# EAGLE design 5VAC-DC (EAGLE 9.6.2)
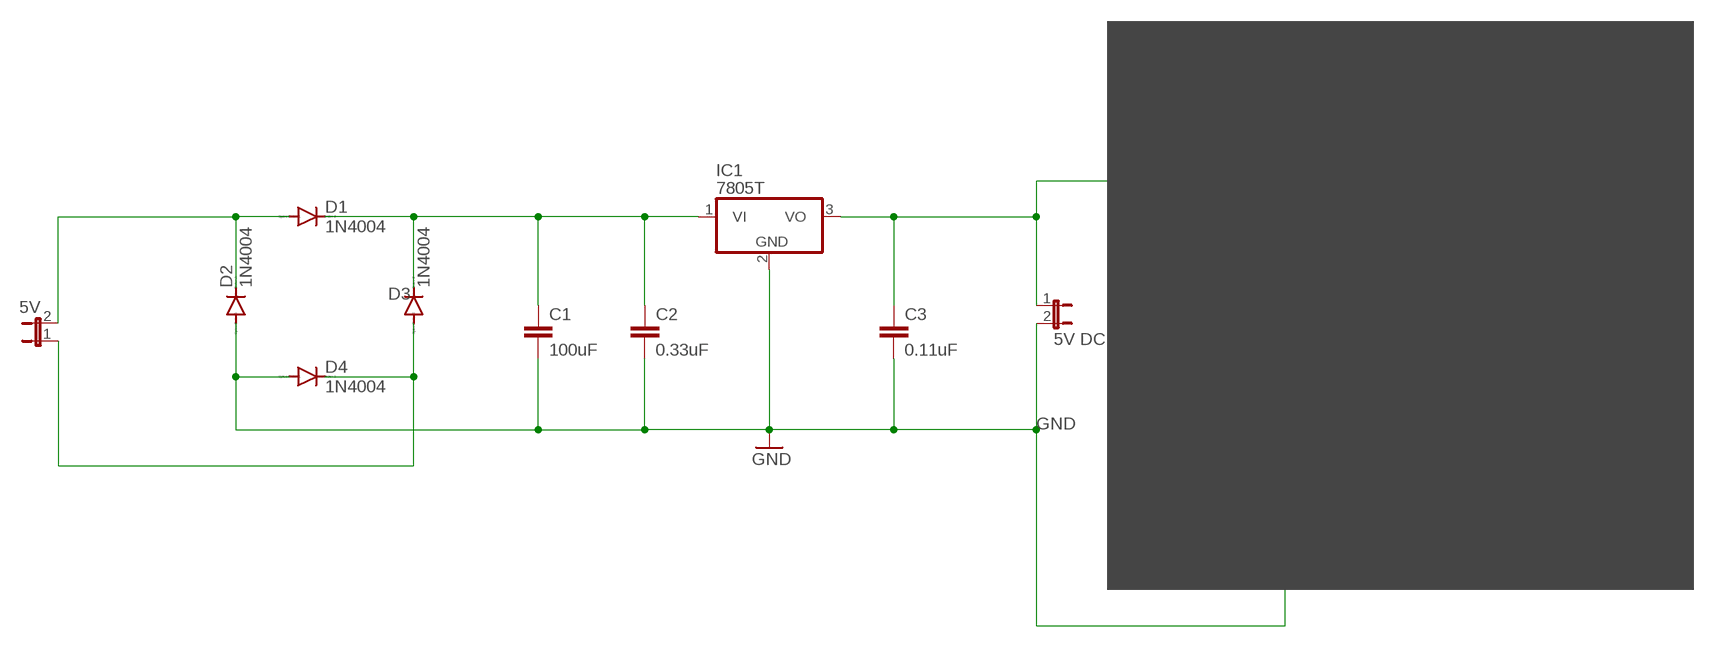
[diagram p0: schematic, sheet 1]

## Parts
C1  100uF  C2,5-3  [C2.5-3]
C2  0.33uF  C2,5-3  [C2.5-3]
C3  0.11uF  C2,5-3  [C2.5-3]
D1  1N4004  [DO41-10]
D2  1N4004  [DO41-10]
D3  1N4004  [DO41-10]
D4  1N4004  [DO41-10]
I/P  5V  JP1E  [JP1]
IC1  7805T  [TO220H]
JP2  5V DC  JP1E  [JP1]
U$1  MEGA8L-DEV  [TQFP-MEGA8]

## Nets
GND: C1.2 C2.2 C3.2 D2.A D4.A IC1.2(GND) JP2.2 U$1.P$9
N$1: D1.A D2.C I/P.2
N$3: D3.A D4.C I/P.1
N$4: C1.1 C2.1 D1.C D3.C IC1.1(VI)
N$7: C3.1 IC1.3(VO) JP2.1 U$1.P$1
Unconnected: U$1.P$2 U$1.P$3 U$1.P$4 U$1.P$5 U$1.P$6 U$1.P$7 U$1.P$8 U$1.P$10 U$1.P$11 U$1.P$12 U$1.P$13 U$1.P$14 U$1.P$15 U$1.P$16 U$1.P$17 U$1.P$18 U$1.P$19 U$1.P$20 U$1.P$21 U$1.P$22 U$1.P$23 U$1.P$24 U$1.P$25 U$1.P$26 U$1.P$27 U$1.P$28 U$1.P$29 U$1.P$30 U$1.P$31 U$1.P$32

## Library data of the parts
C1-C3 = capacitor-wima:C: CAPACITOR naming: grid - package width
D1-D4 = diode:1N4004: DIODE general purpose rectifier, 1 A
I/P JP2 = jumper:JP1E: JUMPER
IC1 = linear:78*: Positive VOLTAGE REGULATOR Source: http://cache.national.com/ds/LM/LM78L05.pdf http://www.fairchildsemi.com/ds/LM/LM7805.pdf
U$1 = anjana:MEGA8L-DEV

## Board
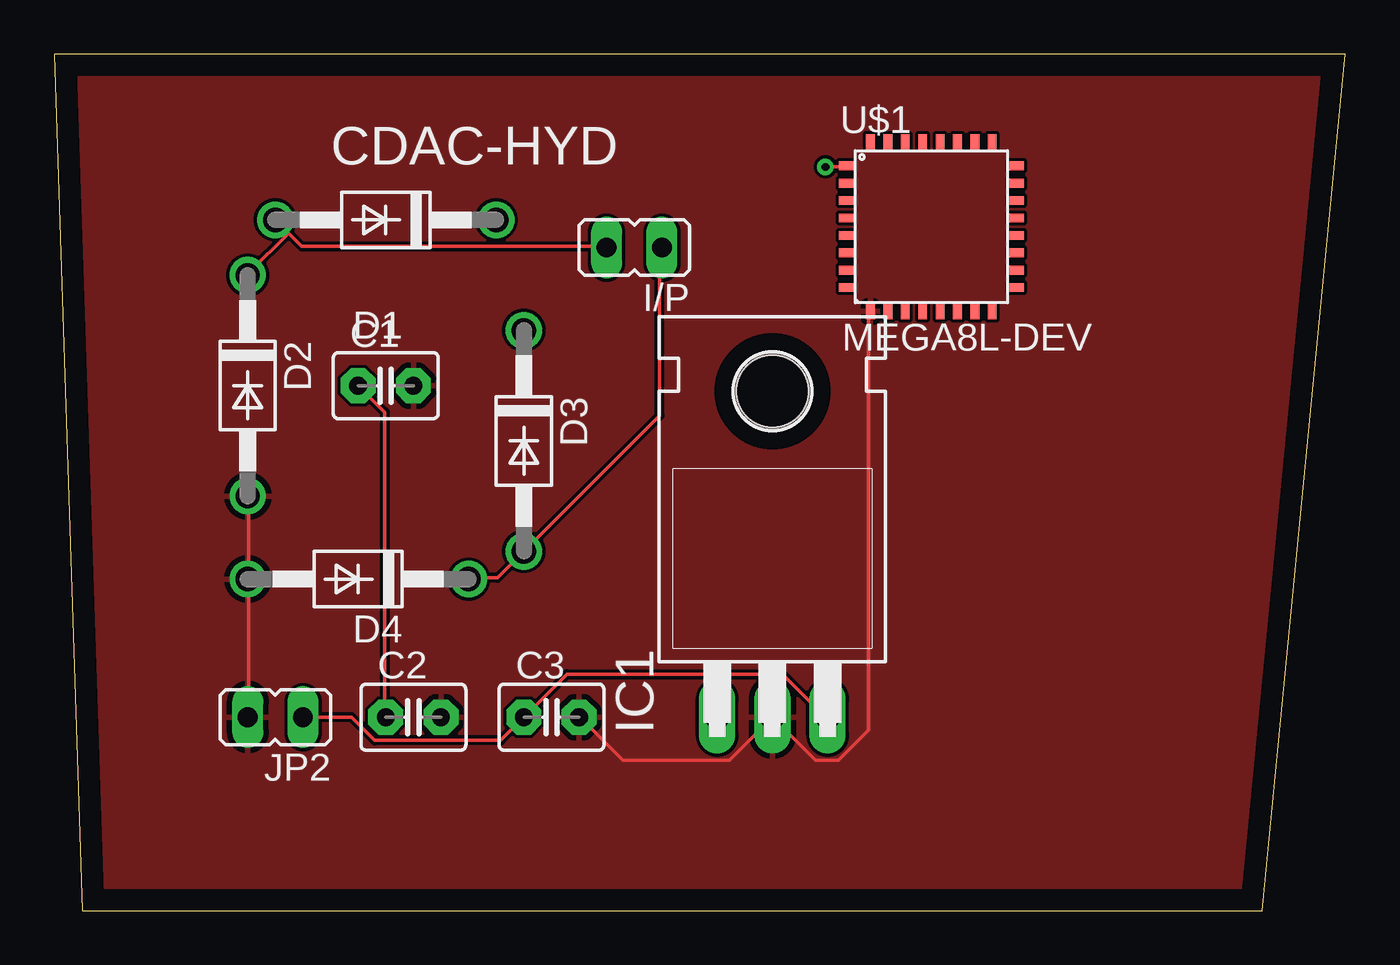
[diagram p1: board, top side]
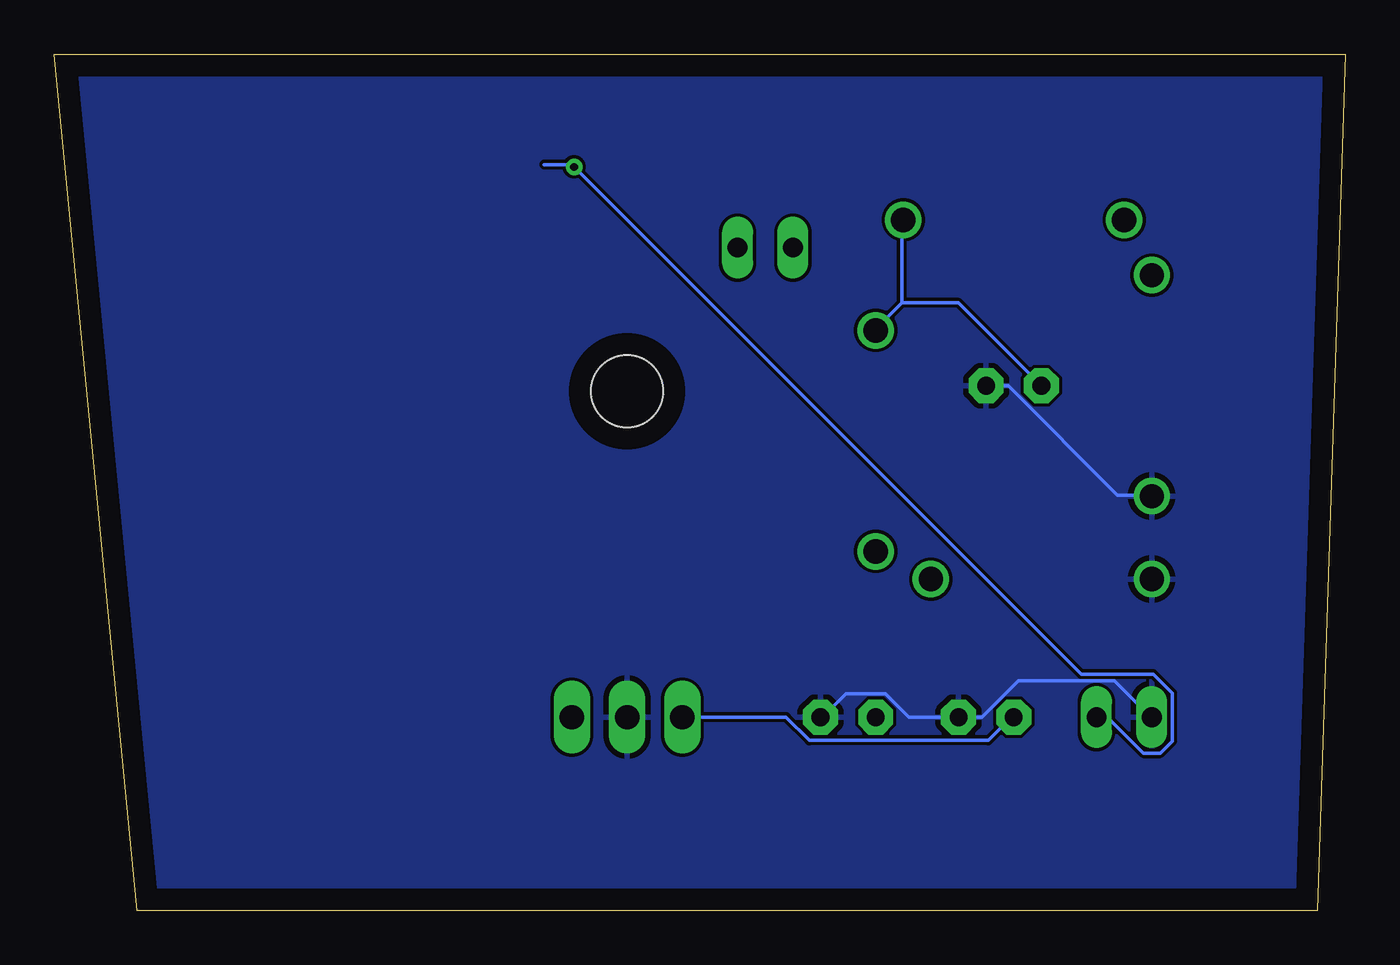
[diagram p2: board, bottom side, seen from below]

Size 59.36 x 39.36 mm. Coordinates in mm from the lower left corner, seen from the top.
Outline: 1.27,0 55.55,0 59.36,39.36 0,39.36 1.27,0
Copper layers (1*16): Top 0.035mm / dielectric 1.5mm / Bottom 0.035mm
Design rules "default": minimum track width 6mil, minimum drill 0.35mm, track to track 6mil, track to pad 6mil, pad to pad 6mil, via to via 6mil, smd to smd 6mil, copper to edge 40mil, drill to drill 6mil, minimum pad ring 10mil, minimum via ring 8mil, stop-mask expansion 4mil, vias tented up to drill 0mil, thermal gap 10mil

### Footprints (pad centres in the part's own frame; a part is rotated, then mirrored left to right if it is on the bottom)
C2.5-3 = drill 0.813 pad 1.6 octagon: 1 -1.27,0; 2 1.27,0
DO41-10 = drill 1.118: A 5.08,0; C -5.08,0
JP1 = drill 0.914 long: 1 0,-1.27; 2 0,1.27
TO220H = drill 1.118 long: 1 -2.54,-10.16; 2 0,-10.16; 3 2.54,-10.16 | hole 3.302: 0,4.826
TQFP-MEGA8 = smd 0.7 x 0.4: P$1 -0.4,6.3; P$2 -0.4,5.5; P$3 -0.4,4.7; P$4 -0.4,3.9; P$5 -0.4,3.1; P$6 -0.4,2.3; P$7 -0.4,1.5; P$8 -0.4,0.7; P$25 7.4,6.3; P$26 7.4,5.5; P$27 7.4,4.7; P$28 7.4,3.9; P$29 7.4,3.1; P$30 7.4,2.3; P$31 7.4,1.5; P$32 7.4,0.7 | smd 0.4 x 0.7: P$9 0.7,-0.4; P$10 1.5,-0.4; P$11 2.3,-0.4; P$12 3.1,-0.4; P$13 3.9,-0.4; P$14 4.7,-0.4; P$15 5.5,-0.4; P$16 6.3,-0.4; P$17 0.7,7.4; P$18 1.5,7.4; P$19 2.3,7.4; P$20 3.1,7.4; P$21 3.9,7.4; P$22 4.7,7.4; P$23 5.5,7.4; P$24 6.3,7.4

### Placement (x,y rotation side)
C1  15.24,24.13 0 top
C2  16.51,8.89 0 top
C3  22.86,8.89 0 top
D1  15.24,31.75 180 top
D2  8.89,24.13 270 top
D3  21.59,21.59 270 top
D4  13.97,15.24 180 top
I/P  26.67,30.48 90 top
IC1  33.02,19.05 0 top
JP2  10.16,8.89 90 top
U$1  36.83,27.94 0 top

### Tracks (layer width: path | path; a pad name or v marks a point on that pad's centre or on a via)
GND
  Top 0.152: C3.2 24.18,8.89 26.16,6.91 31.04,6.91 IC1.2 35,6.91 36.07,6.91 37.44,8.28 37.44,27.48 U$1.P$9 | JP2.2 8.94,8.89 8.94,15.14 D4.A 8.94,15.29 8.94,18.95 D2.A
  Bottom 0.152: C3.2 24.03,8.89 22.96,9.96 21.13,9.96 20.07,8.89 C2.2 16.71,8.89 15.04,10.57 10.62,10.57 8.94,8.89 JP2.2 | C1.2 15.49,24.13 10.46,19.1 8.94,19.1 D2.A
  pour Top: -1.27,40.64 59.69,40.64 60.96,39.37 60.96,31.75 60.96,3.81 54.61,-2.54 2.54,-2.54 0,0 -1.27,1.27
  pour Bottom: -2.54,41.91 -2.54,-3.81 64.77,-3.81 64.77,41.91
N$1
  Top 0.152: D1.A 10.77,31.14 | 10.77,31.14 11.38,30.53 25.4,30.53 I/P.2 | 10.77,31.14 8.94,29.31 D2.C
N$3
  Top 0.152: I/P.1 27.84,30.38 27.84,22.76 D3.A 20.37,15.29 19.15,15.29 D4.C
N$4
  Top 0.152: C1.1 15.19,22.91 15.19,8.89 C2.1
  Bottom 0.152: 20.37,27.94 20.37,31.75 D1.C | 20.37,27.94 21.59,26.72 D3.C | IC1.1 25.7,8.89 24.64,7.82 16.41,7.82 15.34,8.89 C2.1 | 20.37,27.94 17.78,27.94 C1.1
N$7  (via drill 0.35)
  Top 0.152: JP2.1 13.66,8.89 14.73,7.82 20.52,7.82 C3.1 23.57,10.87 33.48,10.87 35.46,8.89 IC1.3 | v35.46,34.19 36.37,34.19 U$1.P$1
  Bottom 0.152: JP2.1 10.93,8.89 9.28,7.24 8.5,7.24 7.95,7.79 7.95,9.99 8.83,10.87 12.14,10.87 v35.46,34.19 35.56,34.29 36.83,34.29

### Text on the board
tPlace: CDAC-HYD
tValues: CDAC-HYD